# EAGLE design Center panel V1.2 (EAGLE 8.3.1)
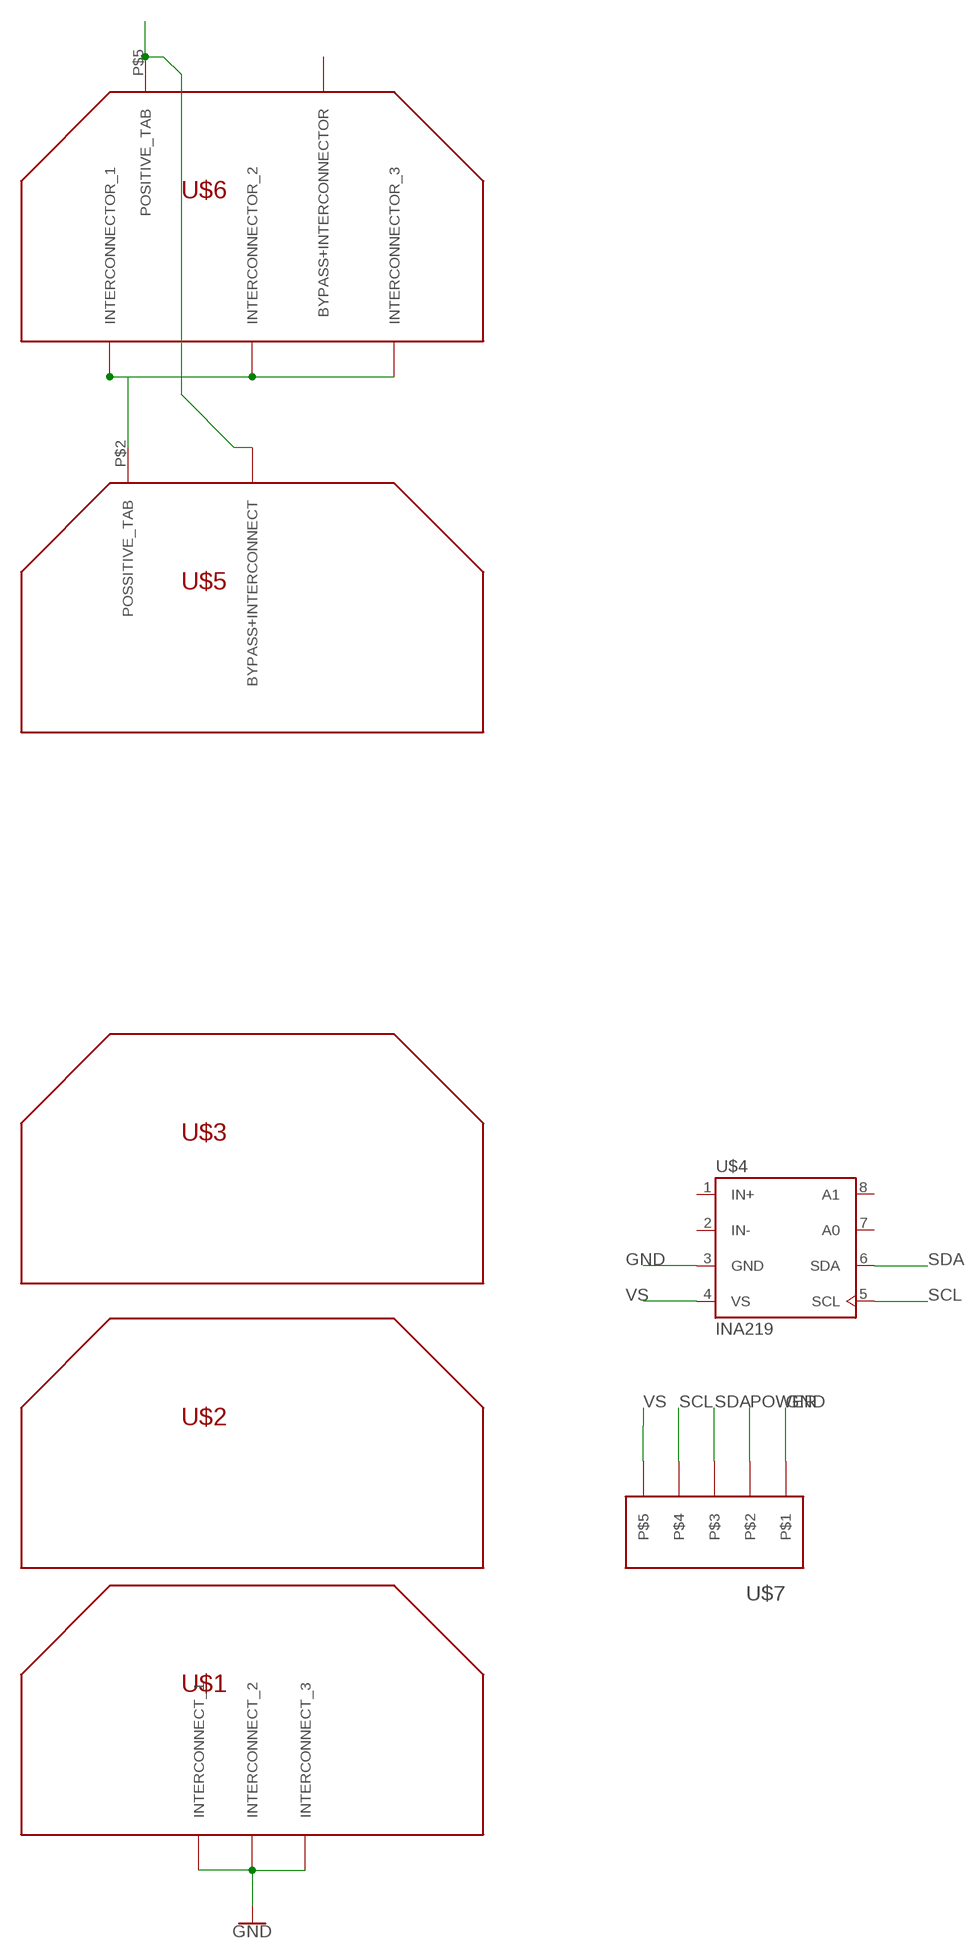
[diagram p0: schematic, sheet 1]

## Parts
U$1  SOLAR_CELL_BOTTOM  [SOLAR_CELL_BOTTOM_SHORT-PADS]
U$2  SOALAR_CELL_OUTLINE  [SOLAR_CELL_OUTLINE]
U$3  SOALAR_CELL_OUTLINE  [SOLAR_CELL_OUTLINE]
U$4  INA219  [S008]
U$5  SOLAR_CELL_TOP  [SOLAR_CELL_TOP_SHORT-PAD]
U$6  SOLAR_CELL_STAND-ALONE  [SOLAR_CELL_STAND-ALONE]
U$7  PICOLOCK_5  [PICOLOCK_5]

## Nets
GND: U$1.P$1(INTERCONNECT_1) U$1.P$2(INTERCONNECT_2) U$1.P$3(INTERCONNECT_3) U$4.3(GND) U$7.P$1
N$7: U$5.P$2(POSSITIVE_TAB) U$6.P$1(INTERCONNECTOR_1) U$6.P$2(INTERCONNECTOR_2) U$6.P$3(INTERCONNECTOR_3)
N$8: U$5.P$1(BYPASS+INTERCONNECT) U$6.P$5(POSITIVE_TAB)
POWER: U$7.P$2
SCL: U$4.5(SCL) U$7.P$4
SDA: U$4.6(SDA) U$7.P$3
VS: U$4.4(VS) U$7.P$5
Unconnected: U$4.1(IN+) U$4.2(IN-) U$4.7(A0) U$4.8(A1) U$6.P$4(BYPASS+INTERCONNECTOR)

## Library data of the parts
U$1 = DubSat1 Components:SOLAR_CELL_BOTTOM: Azurspace Solar cell: http://www.azurspace.com/images/products/0003401-01-01_DB_3G30A.pdf Contains an outline of the cell with pads on the bottom for the main interconnectors. To be used as the bottom cell in a string of cells.
U$2 U$3 = DubSat1 Components:SOALAR_CELL_OUTLINE: Azurspace Solar Cell: http://www.azurspace.com/images/products/0003401-01-01_DB_3G30A.pdf Contains an outline of the solar cell without any pads because the interconnectors will be attached externaly and not on the board. This footprint is to be used as the center cells in a string of cells.
U$4 = DubSat1 Components:INA219: INA219 is an integrated voltage, current, and temperature sensor that comunicates over I2C. Datasheet: http://www.ti.com/lit/ds/symlink/ina219.pdf Used in Dubsat1 in the Power Gen Board and the Solar Panels.
U$5 = DubSat1 Components:SOLAR_CELL_TOP: Azurspace solar cell: http://www.azurspace.com/images/products/0003401-01-01_DB_3G30A.pdf With outline of full cell + pad for top side introconnector and integrated bypass diode. To be used as the top cell in a string of cells.
U$6 = DubSat1 Components:SOLAR_CELL_STAND-ALONE
U$7 = DubSat1 Components:PICOLOCK_5

## Net classes
0 default: clearance 0.205 mm

## Board
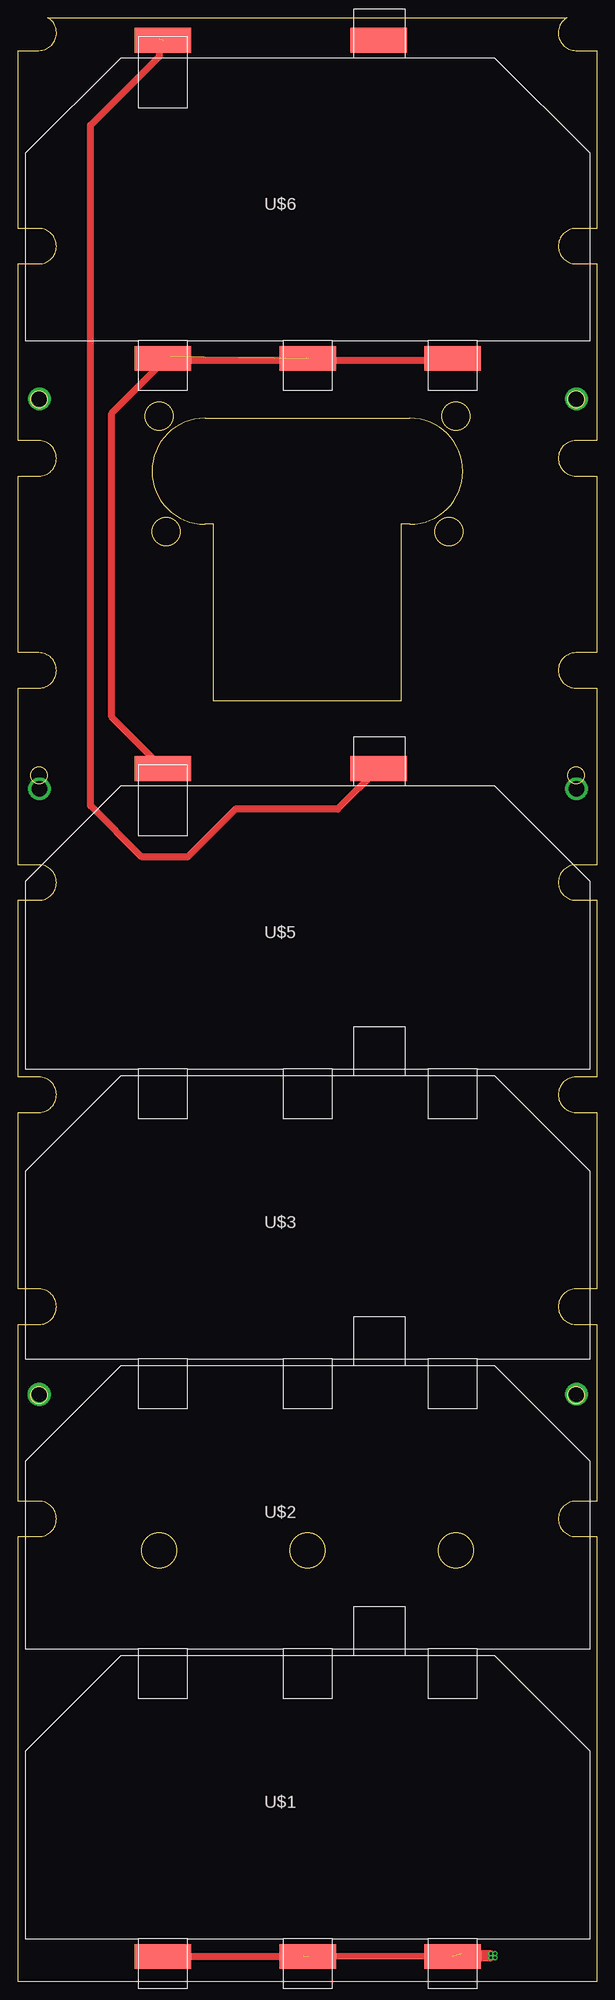
[diagram p1: board, top side]
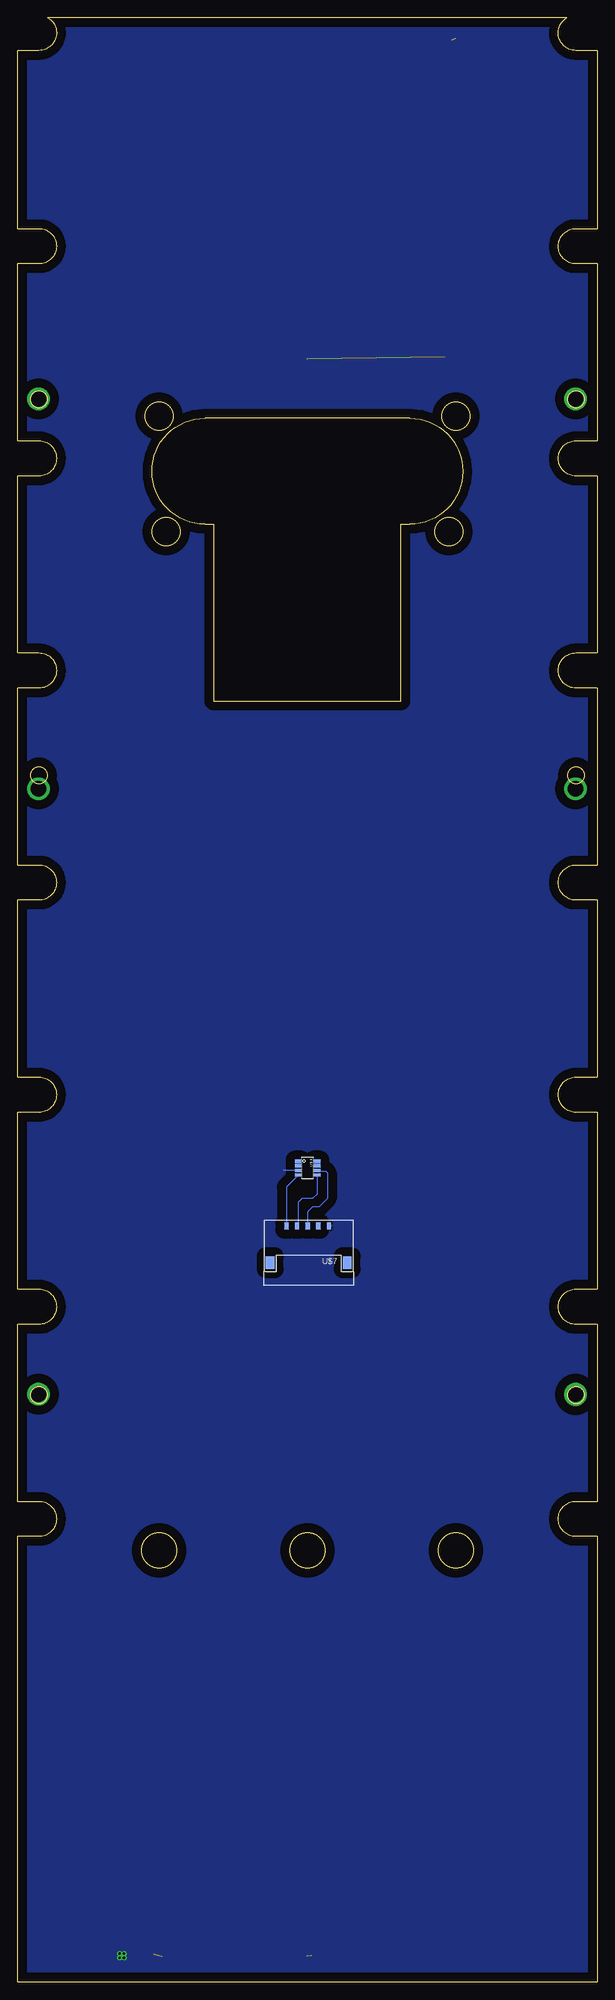
[diagram p2: board, bottom side, seen from below]

Size 82 x 277.8 mm. Coordinates in mm from the lower left corner, seen from the top.
Outline: 27.75,206.15 26.5,206.15 arc-180 26.5,221.15 55.5,221.15 arc-180 55.5,206.15 54.25,206.15 54.25,181.15 27.75,181.15 27.75,206.15
Outline: 79,273.15 82,273.15 82,247.98 79,247.98 arc180 79,242.98 82,242.98 82,217.98 79,217.98 arc180 79,212.98 82,212.98 82,187.98 79,187.98 arc180 79,182.98 82,182.98 82,157.98 79,157.98 arc180 79,152.98 82,152.98 82,127.98 79,127.98 arc180 79,122.98 82,122.98 82,97.98 79,97.98 arc180 79,92.98 82,92.98 82,67.98 79,67.98 arc180 79,62.98 82,62.98 82,0 0,0 0,62.98 3,62.98 arc180 3,67.98 0,67.98 0,92.98 3,92.98 arc180 3,97.98 0,97.98 0,122.98 3,122.98 arc180 3,127.98 0,127.98 0,152.98 3,152.98 arc180 3,157.98 0,157.98 0,182.98 3,182.98 arc180 3,187.98 0,187.98 0,212.98 3,212.98 arc180 3,217.98 0,217.98 0,242.98 3,242.98 arc180 3,247.98 0,247.98 0,273.15 3,273.15 arc149 4.28,277.8 77.72,277.8 arc149 79,273.15
Outline: circle at 62,61 radius 2.5
Outline: circle at 41,61 radius 2.5
Outline: circle at 20,61 radius 2.5
Outline: circle at 20,221.46 radius 2
Outline: circle at 62,221.46 radius 2
Outline: circle at 61,205.13 radius 2
Outline: circle at 21,205.13 radius 2
Outline: circle at 3,223.8 radius 1.19
Outline: circle at 3,83 radius 1.19
Outline: circle at 79,223.8 radius 1.19
Outline: circle at 79,170.65 radius 1.19
Outline: circle at 3,170.65 radius 1.19
Outline: circle at 79,83 radius 1.19
Copper layers (1*16): Top 0.07111875mm / dielectric 2mm / Bottom 0.07111875mm
Design rules "Center panel V1.2": minimum track width 10mil, minimum drill 24mil, track to track 0.205mm, track to pad 0.205mm, pad to pad 0.205mm, via to via 0.205mm, smd to smd 8mil, copper to edge 40mil, drill to drill 8mil, minimum pad ring 10mil, minimum via ring 8mil, stop-mask expansion 4mil, vias tented up to drill 0mil, thermal gap 10mil

### Footprints (pad centres in the part's own frame; a part is rotated, then mirrored left to right if it is on the bottom)
SOLAR_CELL_BOTTOM_SHORT-PADS = smd 8 x 3.5: P$1 19.5,-2.5; P$2 40,-2.5; P$3 60.5,-2.5
S008 = smd 0.45 x 1: 1 -0.975,-1.3; 2 -0.325,-1.3; 3 0.325,-1.3; 4 0.975,-1.3; 5 0.975,1.3; 6 0.325,1.3; 7 -0.325,1.3; 8 -0.975,1.3
SOLAR_CELL_TOP_SHORT-PAD = smd 8 x 3.5: P$1 50,42.5; P$2 19.5,42.5
SOLAR_CELL_STAND-ALONE = smd 8 x 3.5: P$1 19.5,-2.5; P$2 40,-2.5; P$3 60.5,-2.5; P$4 50,42.5; P$5 19.5,42.5
PICOLOCK_5 = smd 1.25 x 1.8: MNT@1 -2.605,5.2; MNT@2 8.305,5.2 | smd 0.6 x 1: P$1 0,0; P$2 1.5,0; P$3 3,0; P$4 4.5,0; P$5 6,0

### Placement (x,y rotation side)
U$1  1.06,6.1 0 top
U$2  1.06,47.1 0 top
U$3  1.06,88.1 0 top
U$4  40.96,115.1 270 bottom
U$5  1.06,129.1 0 top
U$6  1.06,232.1 0 top
U$7  37.96,106.9 180 bottom

### Tracks (layer width: path | path; a pad name or v marks a point on that pad's centre or on a via)
GND  (via drill 0.3)  (2 unrouted)
  Top 1.016: U$1.P$1 40.31,3.6 40.4,3.69 U$1.P$3 | v66.96,4 62.76,4 63.36,3.4 v66.96,3.4
  Bottom 0.152: U$4.3 44.39,114.77 44.46,114.7
  other vias: 67.56,4 67.56,3.4
  pour Bottom (isolate 1.27): 0.06,0.1 0.06,282.9 82.06,282.9 82.06,0.1
N$1  (via drill 2.18)
  other vias: 79.06,223.9
N$2  (via drill 2.2)
  other vias: 3.06,83.1
N$3  (via drill 2.18)
  other vias: 3.06,223.9
N$4  (via drill 2.18)
  other vias: 3.06,168.75
N$5  (via drill 2.18)
  other vias: 79.06,168.75
N$6  (via drill 2.18)
  other vias: 79.06,83.1
N$7  (1 unrouted)
  Top 1.016: U$5.P$2 13.31,178.9 13.31,221.85 20.81,229.35 | 20.81,229.35 21.31,229.85 21.56,229.85 21.31,229.6 U$6.P$1 20.81,229.35 | 20.81,228.85 20.81,229.35 | 20.81,229.35 61.31,229.35 U$6.P$3
N$8  (1 unrouted)
  Top 1.016: U$5.P$1 45.26,165.85 30.81,165.85 24.06,159.1 17.56,159.1 10.31,166.35 10.31,262.6 20.06,272.35 20.06,274.85 20.56,275.35
SCL
  Bottom 0.152: U$4.5 39.66,111.4 40.26,110.8 41.76,110.8 42.36,110.2 42.36,107 U$7.P$4
SDA
  Bottom 0.152: U$4.6 39.59,114.7 38.46,114.7 38.16,114.4 38.16,110.8 39.36,109.6 40.26,109.6 40.96,108.9 U$7.P$3
VS
  Bottom 0.152: U$4.4 43.96,112.42 U$7.P$5